# EAGLE schematic PowerDispatcher (EAGLE 5.11)
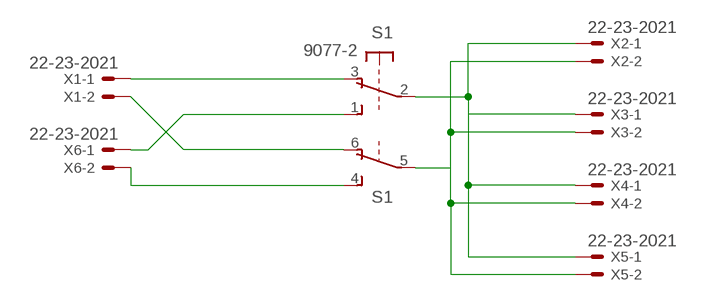
[diagram p0: schematic, sheet 1]

## Parts
S1  9077-2  [9077-2]
X1  22-23-2021  [22-23-2021]
X2  22-23-2021  [22-23-2021]
X3  22-23-2021  [22-23-2021]
X4  22-23-2021  [22-23-2021]
X5  22-23-2021  [22-23-2021]
X6  22-23-2021  [22-23-2021]

## Nets
N$1: S1.3(1:O) X1.1
N$2: S1.6(2:O) X1.2
N$3: S1.1(1:S) X6.1
N$4: S1.4(2:S) X6.2
N$5: S1.2(1:P) X2.1 X3.1 X4.1 X5.1
N$6: S1.5(2:P) X2.2 X3.2 X4.2 X5.2

## Library data of the parts
S1 = switch-misc:9077-2: MARQUARDT SWITCH 9077.0200 Distributor: Buerklin <https://www.buerklin.com/default.asp?event=ShowArtikel%2812G2822%29&l=d&jump=ArtNr_12G2822>
X1-X6 = con-molex:22-23-2021: .100" (2.54mm) Center Header - 2 Pin; MF: MOLEX; MPN: 22-23-2021; OC_FARNELL: 1462926; OC_NEWARK: 25C3832

## Net classes
0 default: width 0.762 mm